# EasyEDA Pro project STM32空调遥控器.eprj, schematic Schematic1
Board Name: Board1; Create Date: 2025-05-03; Page Name: P1; Project Name: STM32空调遥控器; Schematic Name: Schematic1; Update Date: 2025-08-01; Company: 嘉立创EDA; Page Size: A4; Version: V2.0
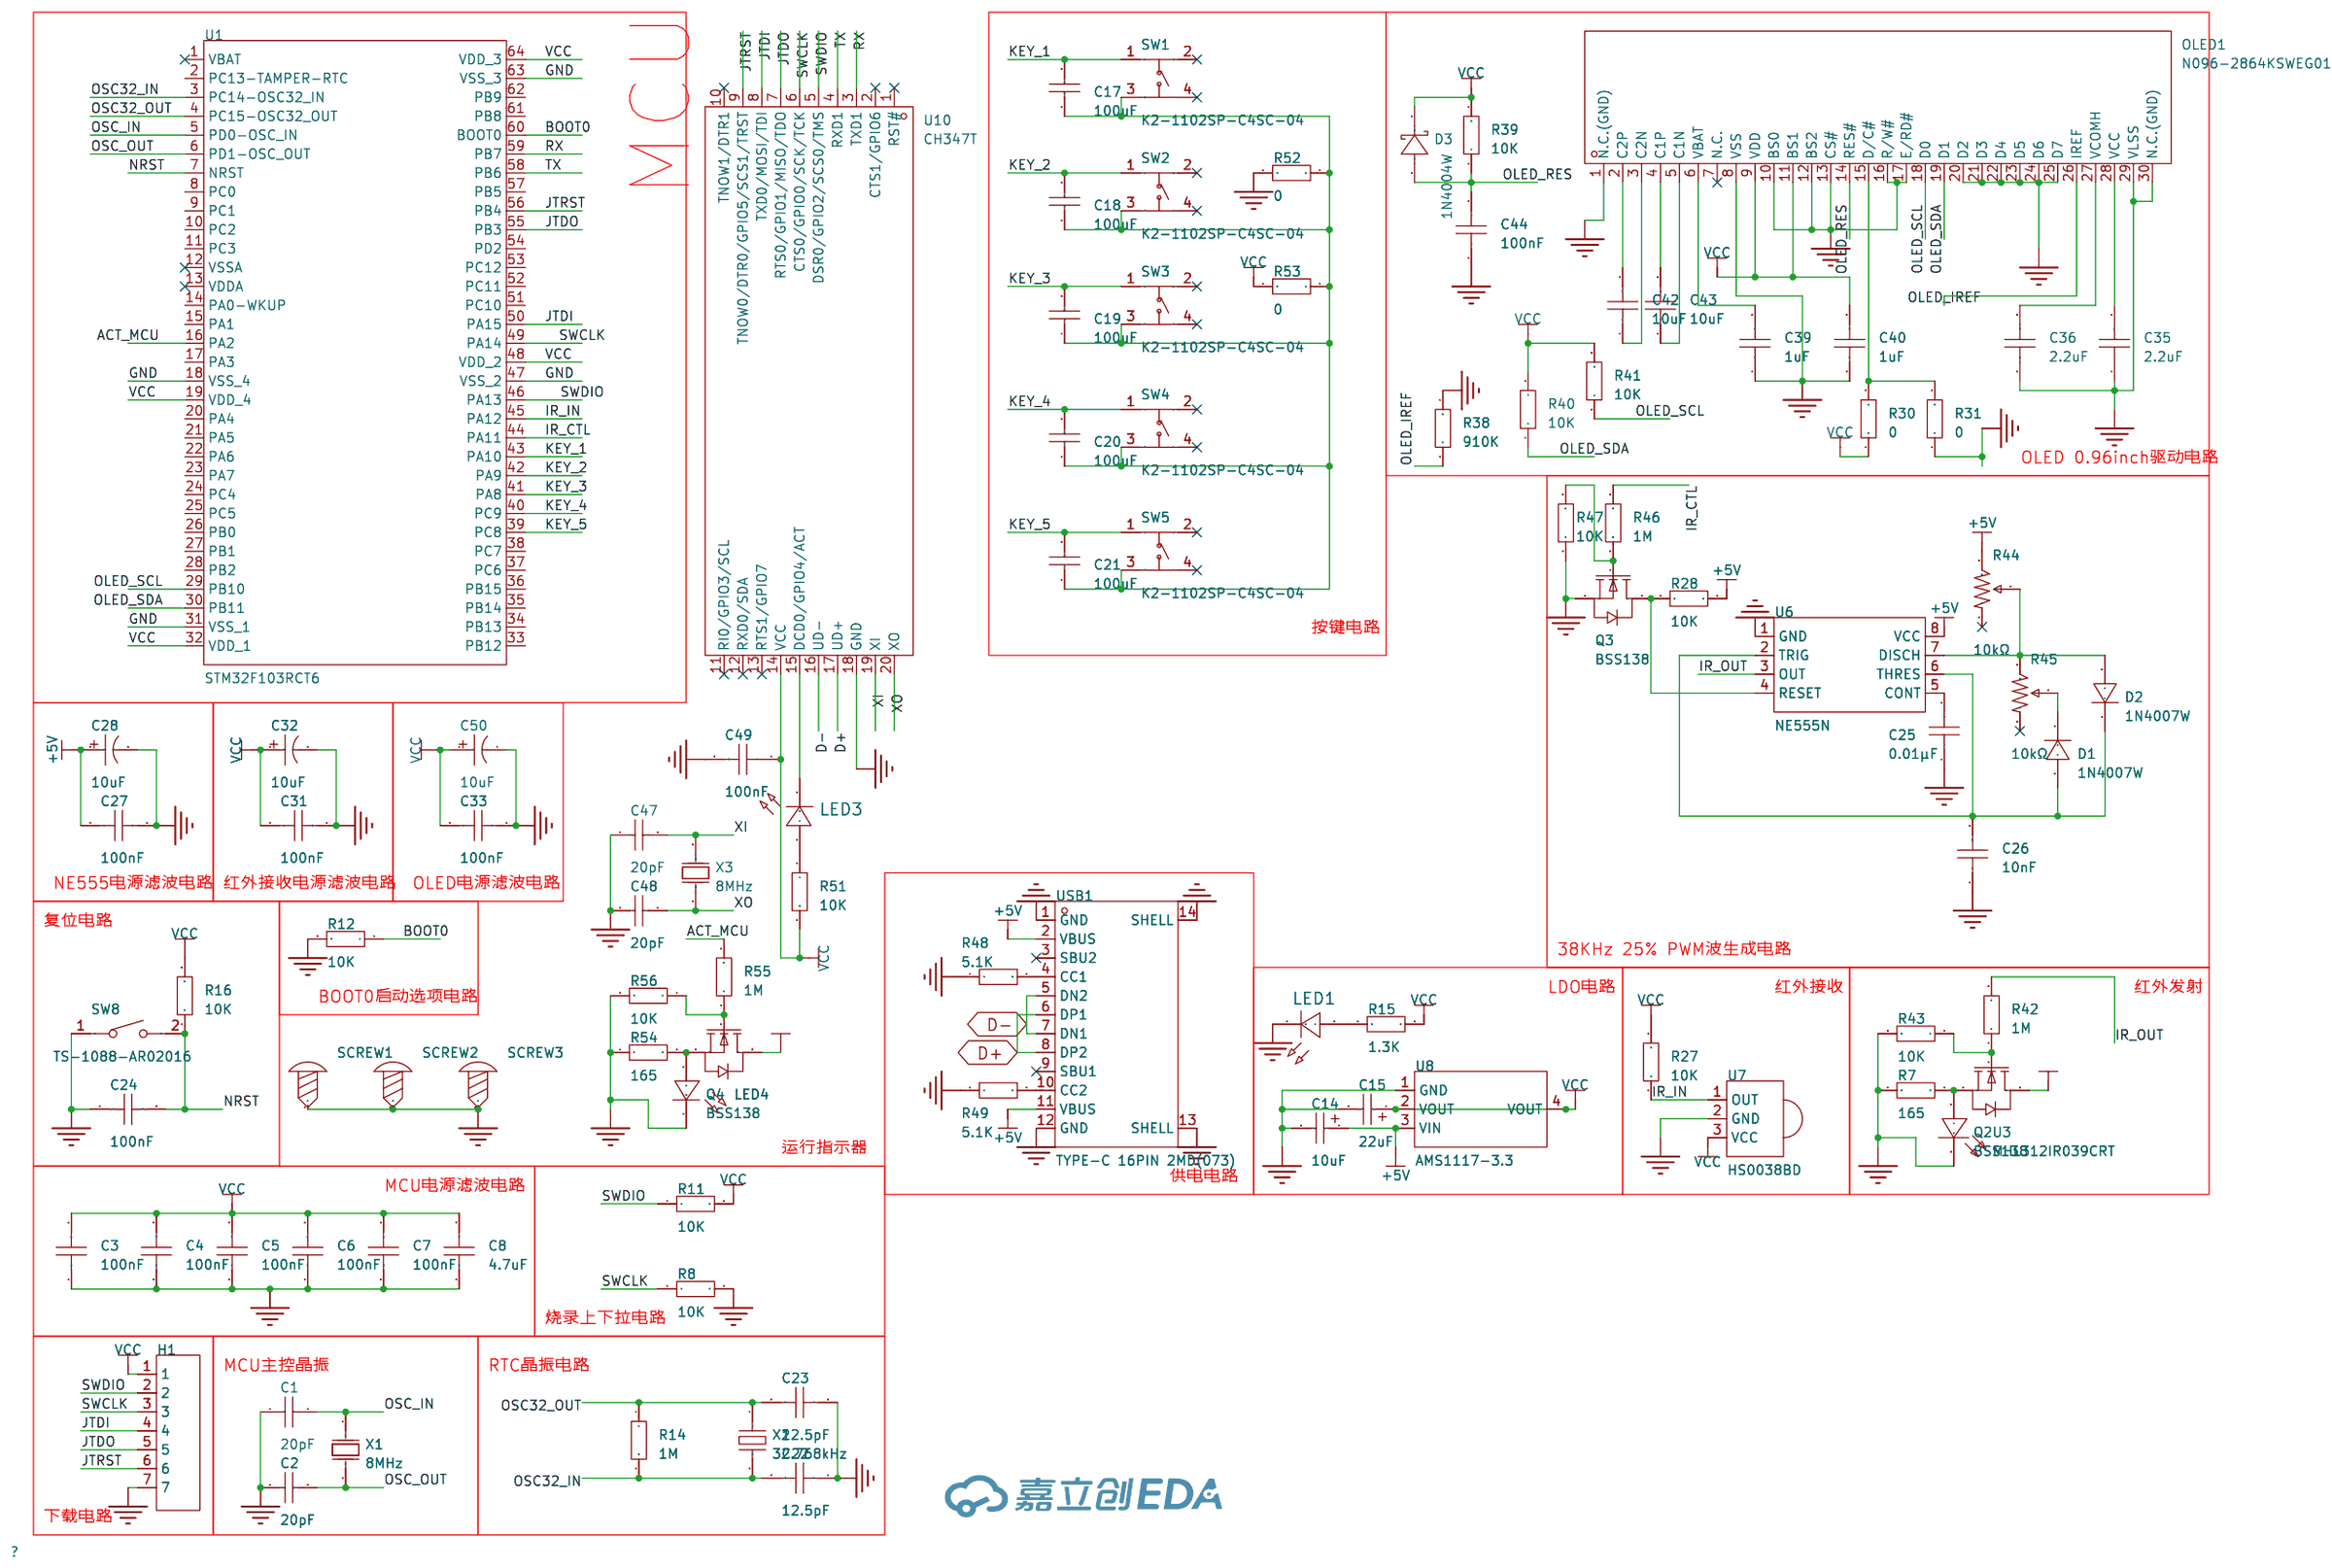
[diagram p0: schematic sheet]

## Parts
C1  20pF  [C0805]
C2  20pF  [C0805]
C3  100nF  [C0805]
C4  100nF  [C0805]
C5  100nF  [C0805]
C6  100nF  [C0805]
C7  100nF  [C0805]
C8  4.7uF  [C0805]
C14  10uF  [CAP-SMD_L3.2-W1.6-RD-C7171]
C15  22uF  [CASE-B_3528]
C17  100uF  [C0805]
C18  100uF  [C0805]
C19  100uF  [C0805]
C20  100uF  [C0805]
C21  100uF  [C0805]
C22  12.5pF  [C0805]
C23  12.5pF  [C0805]
C24  100nF  [C0805]
C25  0.01μF  [C0805]
C26  10nF  [C0805]
C27  100nF  [C0805]
C28  10uF  [CAP-TH_BD4.0-P1.50-D0.8-FD]
C31  100nF  [C0805]
C32  10uF  [CAP-TH_BD4.0-P1.50-D0.8-FD]
C33  100nF  [C0805]
C35  2.2uF  [C0805]
C36  2.2uF  [C0805]
C39  1uF  [C0805]
C40  1uF  [C0805]
C42  10uF  [C0805]
C43  10uF  [C0805]
C44  100nF  [C0805]
C47  20pF  [C0805]
C48  20pF  [C0805]
C49  100nF  [C0805]
C50  10uF  [CAP-TH_BD4.0-P1.50-D0.8-FD]
D1  1N4007W  [SOD-123FL_L2.7-W1.8-LS3.8-RD]
D2  1N4007W  [SOD-123FL_L2.7-W1.8-LS3.8-RD]
D3  1N4004W  [SOD-123FL_L2.7-W1.8-LS3.8-RD]
H1  -  [HDR-TH_7P-P2.54-V-F]
LED1  -  [LED_0805]
LED3  -  [LED_0805]
LED4  -  [LED_0805]
OLED1  N096-2864KSWEG01-H30  [OLED_0.96-30P-P0.70-12864]
Q2  BSS138  [SOT-23-3_L2.9-W1.3-P1.90-LS2.4-BR]
Q3  BSS138  [SOT-23-3_L2.9-W1.3-P1.90-LS2.4-BR]
Q4  BSS138  [SOT-23-3_L2.9-W1.3-P1.90-LS2.4-BR]
R7  165  [R0805]
R8  10K  [R0805]
R11  10K  [R0805]
R12  10K  [R0805]
R14  1M  [R0805]
R15  1.3K  [R0805]
R16  10K  [R0805]
R27  10K  [R0805]
R28  10K  [R0805]
R30  0  [R0805]
R31  0  [R0805]
R38  910K  [R0805]
R39  10K  [R0805]
R40  10K  [R0805]
R41  10K  [R0805]
R42  1M  [R0805]
R43  10K  [R0805]
R44  10kΩ  [RES-ADJ-SMD_3P-L3.0-W3.8-P1.75-BR]
R45  10kΩ  [RES-ADJ-SMD_3P-L3.0-W3.8-P1.75-BR]
R46  1M  [R0805]
R47  10K  [R0805]
R48  5.1K  [R0805]
R49  5.1K  [R0805]
R51  10K  [R0805]
R52  0  [R0805]
R53  0  [R0805]
R54  165  [R0805]
R55  1M  [R0805]
R56  10K  [R0805]
SCREW1  -  [M3螺丝]
SCREW2  -  [M3螺丝]
SCREW3  -  [M3螺丝]
SW1  K2-1102SP-C4SC-04  [KEY-SMD_4P-L6.0-W6.0-P4.50-LS9.5-BL]
SW2  K2-1102SP-C4SC-04  [KEY-SMD_4P-L6.0-W6.0-P4.50-LS9.5-BL]
SW3  K2-1102SP-C4SC-04  [KEY-SMD_4P-L6.0-W6.0-P4.50-LS9.5-BL]
SW4  K2-1102SP-C4SC-04  [KEY-SMD_4P-L6.0-W6.0-P4.50-LS9.5-BL]
SW5  K2-1102SP-C4SC-04  [KEY-SMD_4P-L6.0-W6.0-P4.50-LS9.5-BL]
SW8  TS-1088-AR02016  [SW-SMD_L3.9-W3.0-P4.45]
U1  STM32F103RCT6  [LQFP-64_L10.0-W10.0-P0.50-LS12.0-BL]
U3  MHL312IR039CRT  [LED-TH_BD4.2-P2.54-FD]
U6  NE555N  [DIP-8_L9.8-W6.6-P2.54-LS7.6-BL]
U7  HS0038BD  [OPTO-TH_3P-L6.0-W5.6-P2.54_TSOP14656]
U8  AMS1117-3.3  [SOT-223-3_L6.5-W3.4-P2.30-LS7.0-BR]
U10  CH347T  [TSSOP-20_L6.5-W4.4-P0.65-LS6.4-BL]
USB1  TYPE-C 16PIN 2MD(073)  [USB-C-SMD_TYPE-C-6PIN-2MD-073]
X1  8MHz  [CRYSTAL-SMD_L11.5-W4.8-LS12.7]
X2  32.768kHz  [OSC-SMD_L3.2-W1.5]
X3  8MHz  [CRYSTAL-SMD_L11.5-W4.8-LS12.7]

## Library data of the parts
C1 C2 C47 C48 = CL10C200JB8NNNC: LCSC Part Name: 20pF ±5% 50V; Supplier Part: C1648; Manufacturer: SAMSUNG(三星); Supplier Footprint: 0603; JLCPCB Part Class: 基础库; Datasheet: https://atta.szlcsc.com/upload/public/pdf/source/20160218/1457707763339.pdf; Supplier: LCSC; Tolerance: ±5%; Voltage Rated: 50V; Temperature Coefficient: C0G
C3-C7 = CGA0603X7R104K500JT: LCSC Part Name: 100nF ±10% 50V; Supplier Part: C6119867; Manufacturer: HRE(芯声); Supplier Footprint: 0603; JLCPCB Part Class: 扩展库; Datasheet: https://atta.szlcsc.com/upload/public/pdf/source/20250103/C44077DA9E7B3EFAE02F22B6D3D1CBC9.pdf; Supplier: LCSC; Tolerance: ±10%; Voltage Rating: 50V; Temperature Coefficient: X7R
C8 = CGA0805X7R475K350MT: LCSC Part Name: 4.7uF ±10% 35V; Supplier Part: C6119943; Manufacturer: HRE(芯声); Supplier Footprint: 0805; JLCPCB Part Class: 扩展库; Supplier: LCSC; Tolerance: ±10%; Voltage Rated: 35V; Temperature Coefficient: X7R
C14 = TAJA106K016RNJ: 容值:10uF;精度:±10%;额定电压:16V;等效串联电阻(ESR):3Ω@100kHz;; LCSC Part Name: 10uF ±10% 16V; Supplier Part: C7171; Manufacturer: Kyocera AVX; Supplier Footprint: CASE-A-3216-18(mm); JLCPCB Part Class: 基础库; Supplier: LCSC; Tolerance: ±10%; Voltage Rating: 16V; Equivalent Series Resistance(ESR): 3Ω@100kHz; Operating Temperature: -55℃~+125℃
C15 = TAJB226K016RNJ: 容值:22uF;精度:±10%;额定电压:16V;等效串联电阻(ESR):2.3Ω@100kHz;; LCSC Part Name: 22uF ±10% 16V; Supplier Part: C8020; Manufacturer: Kyocera AVX; Supplier Footprint: CASE-B-3528-21(mm); JLCPCB Part Class: 扩展库; Supplier: LCSC; Tolerance: ±10%; Voltage Rating: 16V; Equivalent Series Resistance(ESR): 2.3Ω@100kHz; Operating Temperature: -55℃~+125℃
C17-C21 = GRM21BR60J107ME15L: LCSC Part Name: 100uF ±20% 6.3V; Supplier Part: C141660; Manufacturer: muRata(村田); Supplier Footprint: 0805; JLCPCB Part Class: 扩展库; Datasheet: https://atta.szlcsc.com/upload/public/pdf/source/20171113/C141660_15105613320671115822.pdf; Supplier: LCSC; Tolerance: ±20%; Voltage Rated: 6.3V; Temperature Coefficient: X5R
C22-C27 C31 C33 C35 C36 C39 C40 C42-C44 C49 = CAP_0805: Supplier Footprint: 0805
C28 C32 C50 = KS106M025C07RR0VH2FP0: 容值:10uF;精度:±20%;额定电压:25V;纹波电流:29mA@120Hz;等效串联电阻:-;; LCSC Part Name: 10uF ±20% 25V; Supplier Part: C43351; Manufacturer: CX(承兴); Supplier Footprint: 插件,D4xL7mm; JLCPCB Part Class: 扩展库; Datasheet: https://atta.szlcsc.com/upload/public/pdf/source/20211027/7B10195EF01EB9374BE8935690E3D906.pdf; Supplier: LCSC; Tolerance: ±20%; Rated Voltage: 25V; Ripple Current: 29mA@120Hz; Lead Spacing: 1.5mm; φD: 4mm; L: 7mm; Lifetime @ Temp: 1000hrs@105℃; Operating Temperature: -40℃~+105℃
D1 D2 = 1N4007W_C18199088: Supplier Part: C18199088; Manufacturer: 宏迦橙; Supplier Footprint: SOD-123FL; JLCPCB Part Class: 扩展库; Datasheet: https://atta.szlcsc.com/upload/public/pdf/source/20230925/B0AB2B510D392D7083D021E804ED238F.pdf; Supplier: LCSC; Diode Configuration: 独立式; Forward Voltage (Vf@If): 1V@1.0A; Reverse Voltage (Vr): 1kV; Rectified Current: 1A; Reverse Leakage Current (Ir): 2uA@1000V
D3 = 1N4004W_C18199087: Supplier Part: C18199087; Manufacturer: 宏迦橙; Supplier Footprint: SOD-123FL; JLCPCB Part Class: 扩展库; Datasheet: https://atta.szlcsc.com/upload/public/pdf/source/20230925/B0AB2B510D392D7083D021E804ED238F.pdf; Supplier: LCSC; Diode Configuration: 独立式; Forward Voltage (Vf@If): 1V@1.0A; Reverse Voltage (Vr): 400V; Rectified Current: 1A; Reverse Leakage Current (Ir): 2uA@400V
H1 = HDR-F_2.54_1x7P: Supplier Part: C124418; Supplier Footprint: 插件
LED1 LED3 = LED_0805-R: Supplier Footprint: 0805
LED4 = LED_0805-G: Supplier Footprint: 0805
OLED1 = N096-2864KSWEG01-H30: LCSC Part Name: 0.96寸 白色 128x64像素分辨率 单色 30PIN; Supplier Part: C2890596; Manufacturer: Newvision(新智景); JLCPCB Part Class: 扩展库; Supplier: LCSC; Main Control Chip: SSD1306; Size: 0.96
Q2-Q4 = BSS138_C7420339: LCSC Part Name: N沟道,电流:340mA,耐压:50V; Supplier Part: C7420339; Manufacturer: 宏嘉诚; Supplier Footprint: SOT-23; JLCPCB Part Class: 扩展库; Datasheet: https://atta.szlcsc.com/upload/public/pdf/source/20250106/6679E24F3D42D0BF4A4F6E14986335A4.pdf; Supplier: LCSC; Type: 1个N沟道; Drain to Source Voltage: 50V; Current - Continuous Drain(Id): 340mA; RDS(on): 2.5Ω@10V,340mA; Pd - Power Dissipation: 350mW; Gate Threshold Voltage (Vgs(th)@Id): 1.6V; Gate Charge(Qg): 1.7nC@10V; Input Capacitance(Ciss@Vds): 17.5pF@25V; Reverse Transfer Capacitance (Crss@Vds): 6.5pF@25V; Operating Temperature: -55℃~+150℃
R7 R8 R11 R12 R14-R16 R27 R28 R30 R31 R38-R43 R46-R49 R51-R56 = Res_0805: Supplier Footprint: 0805
R44 R45 = TC33X-2-103E: LCSC Part Name: 10kΩ ±25%; Supplier Part: C719176; Manufacturer: BOURNS; Supplier Footprint: SMD-3P,3.8x3.6mm; JLCPCB Part Class: 扩展库; Datasheet: https://atta.szlcsc.com/upload/public/pdf/source/20200810/C720646_BB66A75E654D5E1D30127FF45BCD3C26.pdf; Supplier: LCSC; Tolerance: ±25%; Power(Watts): 150mW; Temperature Coefficient: ±250ppm/℃; Number of Turns: 1
SCREW1-SCREW3 = M3螺丝: Supplier Footprint: 插件
SW1-SW5 = K2-1102SP-C4SC-04: LCSC Part Name: K2-1102SP-C4SC-04 贴片; Supplier Part: C127509; Manufacturer: 韩国韩荣; Supplier Footprint: SMD; JLCPCB Part Class: Extended Part; Datasheet: https://atta.szlcsc.com/upload/public/pdf/source/20180911/C188182_290538218D9CAA74C9E437566D743B7F.pdf; Supplier: LCSC; Circuit: 单刀单掷; Actuator Style: 圆形按钮; Operating Force: 250gf; Mounting Style: 立贴; Switch Length: 6mm; Switch Width: 6mm; Switch Height: 5mm; Contact Current: 50mA; Voltage Rating (DC): 12V; Insulation Resistance: 100MΩ; Mechanical Life: 10万次; Operating Temperature: -25℃~+85℃
SW8 = TS-1088-AR02016: 电路结构:单刀单掷;按钮形状:圆形按钮;作用力:160gf;安装方式:立贴;开关长度:4mm;开关宽度:3mm;开关高度:2mm;带支架:不带;触点电流:50mA;额定电压(DC):12V;绝缘电阻:100MΩ;机械寿命:10万次;; LCSC Part Name: 4*3*2mm 立贴 轻触开关; Supplier Part: C720477; Manufacturer: XUNPU(讯普); Supplier Footprint: SMD; JLCPCB Part Class: 扩展库; Datasheet: https://atta.szlcsc.com/upload/public/pdf/source/20200810/C720475_60D09DD6C54279ADDB2DC25100F1CC11.pdf; Supplier: LCSC; Circuit: 单刀单掷; Actuator Style: 圆形按钮; Operating Force: 160gf; Mounting Style: 立贴; Switch Length: 4mm; Switch Width: 3mm; Switch Height: 2mm; Strike Gundam: 不带; Contact Current: 50mA; Voltage Rating (DC): 12V; Insulation Resistance: 100MΩ; Actuator/Cap Color: 黑色; Pin Style: SMD接片; Mechanical Life: 10万次; Operating Temperature: -30℃~+80℃
U1 = STM32F103RCT6: LCSC Part Name: 主流增强型ARM Cortex-M3 MCU，具有256 KB Flash、72 MHz CPU、电机控制、USB和CAN; Supplier Part: C8323; Manufacturer: ST(意法半导体); Supplier Footprint: LQFP-64(10x10); JLCPCB Part Class: 扩展库; Datasheet: https://atta.szlcsc.com/upload/public/pdf/source/20180207/C88442_15179953708671359491.pdf; Supplier: LCSC; CPU Core: ARM-M3; CPU Maximum Speed: 72MHz; Program Storage Size: 256KB; Program Memory Type: FLASH; Number of I/O: 51; ADC (Bit): 12bit; DAC (Bit): 12bit; Low Voltage Detection Threshold: 2V~3.6V
U3 = MHL312IR039CRT: LCSC Part Name: F3红外发射二极管透明IR940nm30°; Supplier Part: C405274; Manufacturer: MEIHUA(美华); Supplier Footprint: 插件,D=3mm; JLCPCB Part Class: 扩展库; Datasheet: https://atta.szlcsc.com/upload/public/pdf/source/20190718/C405274_8CC5D026B1BD9DEE9D461B5FE36AEA0D.pdf; Supplier: LCSC; Vf - Forward Voltage: 1.3V~1.8V; Wavelength: 940nm; Radiant Intensity: 15mW/sr；75mW/sr; Current - DC Forward (If): 20mA；100mA; Reverse Voltage: 5V; View Angle: 30°; Operating Temperature: -25℃~+85℃
U6 = NE555N_C398063: LCSC Part Name: 时基集成芯片; Supplier Part: C398063; Manufacturer: HGSEMI(华冠); Supplier Footprint: DIP-8; JLCPCB Part Class: 扩展库; Datasheet: https://atta.szlcsc.com/upload/public/pdf/source/20210507/C398063_2BAEB56D23EF029756B1D4DE6D68B235.pdf; Supplier: LCSC
U7 = HS0038BD: Supplier Part: C524573; Manufacturer: VISHAY(威世); Supplier Footprint: SIP-3; JLCPCB Part Class: 扩展库; Datasheet: https://atta.szlcsc.com/upload/public/pdf/source/20240321/171AF5F17F1EBF6E6986FBB1C30016B3.pdf; Supplier: LCSC
U8 = AMS1117-3.3_C6186: LCSC Part Name: 输出3.3V 1A; Supplier Part: C6186; Manufacturer: AMS; Supplier Footprint: SOT-223; JLCPCB Part Class: 基础库; Datasheet: https://atta.szlcsc.com/upload/public/pdf/source/20180727/C6186_7A095716F0823C02F1997A905E26C086.pdf; Supplier: LCSC; Output Type: 固定; Output Voltage: 3.3V; Output Current: 1A; Power Supply Rejection Ratio (PSRR): 72dB@(120Hz); Voltage Dropout: 1.3V@(800mA); Features: 过流保护(OCP)；热关断(TSD); Output Configuration: 正极; Number of Outputs: 1
U10 = CH347T: LCSC Part Name: 高速USB转接芯片CH347; Supplier Part: C5122332; Manufacturer: WCH(南京沁恒); Supplier Footprint: TSSOP-20; JLCPCB Part Class: 扩展库; Datasheet: https://atta.szlcsc.com/upload/public/pdf/source/20240313/6D00AFFDD61A30A4DD0241161AD59922.pdf; Supplier: LCSC; Applications Function: USB转UART；USB转SPI；USB转I2C；USB转JTAG; Protocol: USB 2.0; Number of Channels: 2; Supply Voltage: 3.6V；3V；3.3V; Data Rate: 9Mbps; Operating Temperature: -40℃~+85℃
USB1 = TYPE-C 16PIN 2MD(073): LCSC Part Name: Type-C 母 卧贴; Supplier Part: C2765186; Manufacturer: SHOU HAN(首韩); Supplier Footprint: SMD; JLCPCB Part Class: 扩展库; Datasheet: https://atta.szlcsc.com/upload/public/pdf/source/20250506/FFB74EDFDFA0AC372CE4A8E4F739CCEF.pdf; Supplier: LCSC; Connector Type: Type-C; Protocol Standard: USB 3.1; Gender: 母; Mounting Type: 卧贴; Number of Contacts: 16P; Number of Ports: 1; Current Rating-Power: 3A; Voltage Rating: 5V; Connect-Disconnect Life: 5千次; Detection color: 黑色; Operating Temperature: -25℃~+85℃
X1 X3 = X49SM8MSD2SC: LCSC Part Name: 8MHz ±20ppm 20pF; Supplier Part: C12674; Manufacturer: YXC(扬兴晶振); Supplier Footprint: HC-49S-SMD; JLCPCB Part Class: 基础库; Datasheet: https://atta.szlcsc.com/upload/public/pdf/source/20240329/3EBF42EBCAB50CA65B6FA9D7CFA1955A.pdf; Supplier: LCSC; Crystal Type: 贴片晶振; Normal temperature Frequency Tolerance: ±20ppm; External load capacitor: 20pF; Frequency Stability(Full temperature range): ±30ppm; Operating Temperature: -20℃~+70℃
X2 = X321532768KGD2SI: 晶振类型:贴片晶振;频率:32.768kHz;常温频差:±20ppm;外接负载电容:12.5pF;频率稳定度(全温):-;; LCSC Part Name: 32.768kHz ±20ppm 12.5pF; Supplier Part: C620155; Manufacturer: YXC(扬兴晶振); Supplier Footprint: SMD3215-2P; JLCPCB Part Class: 扩展库; Datasheet: https://atta.szlcsc.com/upload/public/pdf/source/20240329/3A7650FD985DD0DE85694D3785AB4916.pdf; Supplier: LCSC; Crystal Type: 贴片晶振; Normal temperature Frequency Tolerance: ±20ppm; External load capacitor: 12.5pF; Operating Temperature: -40℃~+85℃

## Nets
+5V: C14.1 C27.1 C28.1 Q2.3(D) Q4.3(D) R28.2 R44.3 U6.8(VCC) U8.3(VIN) USB1.2(VBUS) USB1.11(VBUS)
GND: C1.1 C2.1 C3.1 C4.1 C5.1 C6.1 C7.1 C8.1 C14.2 C15.2 C22.1 C23.1 C24.1 C25.1 C26.1 C27.2 C28.2 C31.2 C32.2 C33.2 C35.1 C36.1 C39.1 C40.1 C44.1 C47.1 C48.1 C49.2 C50.2 H1.7 LED1.1(C) LED4.1(C) OLED1.1(N.C.(GND)) OLED1.8(VSS) OLED1.10(BS0) OLED1.12(BS2) OLED1.13(CS#) OLED1.16(R/W#) OLED1.17(E/RD#) OLED1.20(D2) OLED1.21(D3) OLED1.22(D4) OLED1.23(D5) OLED1.24(D6) OLED1.25(D7) OLED1.29(VLSS) OLED1.30(N.C.(GND)) Q3.2(S) R7.1 R8.2 R12.2 R31.1 R38.1 R43.2 R47.1 R48.1 R49.1 R52.2 R54.1 R56.2 SCREW1.1 SCREW2.1 SCREW3.1 SW8.1 U1.18(VSS_4) U1.31(VSS_1) U1.47(VSS_2) U1.63(VSS_3) U3.2(K) U6.1(GND) U7.2(GND) U8.1(GND) U10.18(GND) USB1.1(GND) USB1.12(GND) USB1.13(SHELL) USB1.14(SHELL)
VCC: C3.2 C4.2 C5.2 C6.2 C7.2 C8.2 C15.1 C31.1 C32.1 C33.1 C40.2 C49.1 C50.1 D3.1(K) H1.1 OLED1.9(VDD) OLED1.11(BS1) R11.2 R15.2 R16.2 R27.2 R30.1 R39.2 R40.2 R41.2 R51.2 R53.2 U1.19(VDD_4) U1.32(VDD_1) U1.48(VDD_2) U1.64(VDD_3) U7.3(VCC) U8.2(VOUT) U8.4(VOUT) U10.14(VCC)
ACT_MCU: R55.2 U1.16(PA2)
BOOT0: R12.1 U1.60(BOOT0)
D+: U10.17(UD+) USB1.6(DP1) USB1.8(DP2)
D-: U10.16(UD-) USB1.5(DN2) USB1.7(DN1)
IR_CTL: R46.2 U1.44(PA11)
IR_IN: R27.1 U1.45(PA12) U7.1(OUT)
IR_OUT: R42.2 U6.3(OUT)
JTDI: H1.4 U1.50(PA15) U10.8(TXD0/MOSI/TDI)
JTDO: H1.5 U1.55(PB3) U10.7(RTS0/GPIO1/MISO/TDO)
JTRST: H1.6 U1.56(PB4) U10.9(TNOW0/DTR0/GPIO5/SCS1/TRST)
KEY_1: C17.2 SW1.1 U1.43(PA10)
KEY_2: C18.2 SW2.1 U1.42(PA9)
KEY_3: C19.2 SW3.1 U1.41(PA8)
KEY_4: C20.2 SW4.1 U1.40(PC9)
KEY_5: C21.2 SW5.1 U1.39(PC8)
NRST: C24.2 R16.1 SW8.2 U1.7(NRST)
OLED_IREF: OLED1.26(IREF) R38.2
OLED_RES: C44.2 D3.2(A) OLED1.14(RES#) R39.1
OLED_SCL: OLED1.18(D0) R41.1 U1.29(PB10)
OLED_SDA: OLED1.19(D1) R40.1 U1.30(PB11)
OSC32_IN: C22.2 R14.2 U1.3(PC14-OSC32_IN) X2.2
OSC32_OUT: C23.2 R14.1 U1.4(PC15-OSC32_OUT) X2.1
OSC_IN: C1.2 U1.5(PD0-OSC_IN) X1.1(OSC1)
OSC_OUT: C2.2 U1.6(PD1-OSC_OUT) X1.2(OSC2)
RX: U1.59(PB7) U10.3(TXD1)
SWCLK: H1.3 R8.1 U1.49(PA14) U10.6(CTS0/GPIO0/SCK/TCK)
SWDIO: H1.2 R11.1 U1.46(PA13) U10.5(DSR0/GPIO2/SCS0/TMS)
TX: U1.58(PB6) U10.4(RXD1)
XI: C47.2 U10.19(XI) X3.1(OSC1)
XO: C48.2 U10.20(XO) X3.2(OSC2)
$1N2657: C17.1 C18.1 C19.1 C20.1 C21.1 R52.1 R53.1 SW1.3 SW2.3 SW3.3 SW4.3 SW5.3
$1N5313: Q2.2(S) R7.2 U3.1(A)
$1N6331: LED1.2(A) R15.1
$1N7061: Q3.3(D) R28.1 U6.4(RESET)
$1N7750: C25.2 U6.5(CONT)
$1N7809: C26.2 D1.2(A) D2.1(K) U6.2(TRIG) U6.6(THRES)
$1N7888: D2.2(A) R44.2 R45.3 U6.7(DISCH)
$1N9996: D1.1(K) R45.2
$1N16904: C35.2 OLED1.28(VCC)
$1N16987: C36.2 OLED1.27(VCOMH)
$1N17245: C39.2 OLED1.6(VBAT)
$1N17593: OLED1.15(D/C#) R30.2 R31.2
$1N27947: C42.2 OLED1.2(C2P)
$1N27951: C43.2 OLED1.4(C1P)
$1N27956: C43.1 OLED1.5(C1N)
$1N27972: C42.1 OLED1.3(C2N)
$1N31898: R48.2 USB1.4(CC1)
$1N31900: R49.2 USB1.10(CC2)
$1N32166: LED3.2(A) R51.1
$1N32261: LED3.1(C) U10.15(DCD0/GPIO4/ACT)
Net-(LED4-2): LED4.2(A) Q4.2(S) R54.2
Net-(Q2-1): Q2.1(G) R42.1 R43.1
Net-(Q3-1): Q3.1(G) R46.1 R47.2
Net-(Q4-1): Q4.1(G) R55.1 R56.1

Not connected (* = marked no-connect by the designer): OLED1 7(N.C.)*; R44 1*; R45 1*; SW1 2* 4*; SW2 2* 4*; SW3 2* 4*; SW4 2* 4*; SW5 2* 4*; U1 1(VBAT)* 2(PC13-TAMPER-RTC) 8(PC0) 9(PC1) 10(PC2) 11(PC3) 12(VSSA)* 13(VDDA)* 14(PA0-WKUP) 15(PA1) 17(PA3) 20(PA4) 21(PA5) 22(PA6) 23(PA7) 24(PC4) 25(PC5) 26(PB0) 27(PB1) 28(PB2) 33(PB12) 34(PB13) 35(PB14) 36(PB15) 37(PC6) 38(PC7) 51(PC10) 52(PC11) 53(PC12) 54(PD2) 57(PB5) 61(PB8) 62(PB9); U10 1(RST#)* 2(CTS1/GPIO6)* 10(TNOW1/DTR1)* 11(RI0/GPIO3/SCL)* 12(RXD0/SDA)* 13(RTS1/GPIO7)*; USB1 3(SBU2)* 9(SBU1)*

## Notes on the sheet
- MCU
- OLED 0.96inch驱动电路
- 按键电路
- NE555电源滤波电路
- 红外接收电源滤波电路
- OLED电源滤波电路
- 复位电路
- 38KHz 25% PWM波生成电路
- LDO电路
- 红外接收
- 红外发射
- BOOT0启动选项电路
- 运行指示器
- MCU电源滤波电路
- 供电电路
- 烧录上下拉电路
- MCU主控晶振
- RTC晶振电路
- 下载电路
